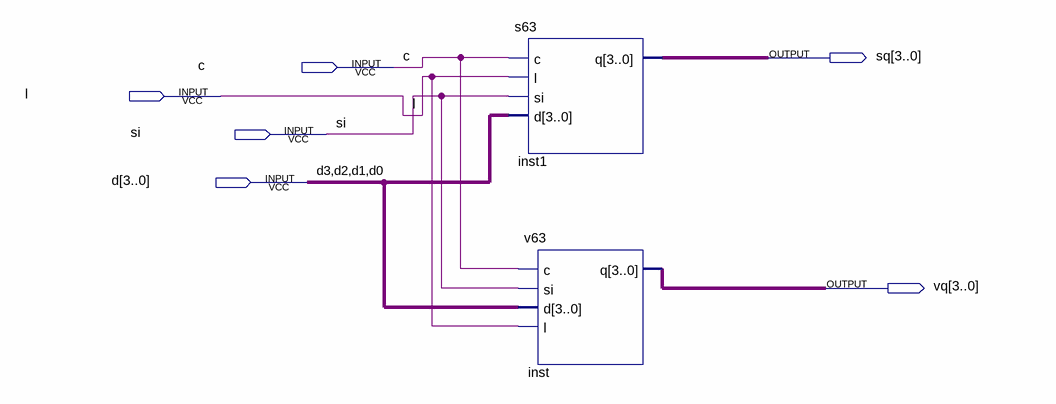
[diagram p0: schematic sheet]
// Quartus schematic sv63.bdf as structural Verilog: 2 symbols, 6 pins
module sv63 (
  input  c,
  input  l,
  input  si,
  input  [3:0] d,
  output [3:0] sq,
  output [3:0] vq
);

  s63 inst1 (.c(c), .l(l), .si(si), .d(d), .q(sq));
  v63 inst (.c(c), .si(si), .d(d), .l(l), .q(vq));
endmodule
